# Altium schematic sheet power_supply.SchDoc: Triumvi - MCU - Power supply
size Letter; Author: Ye-Sheng Kuo; Revision: 9; SheetNumber: 3; SheetTotal: 5
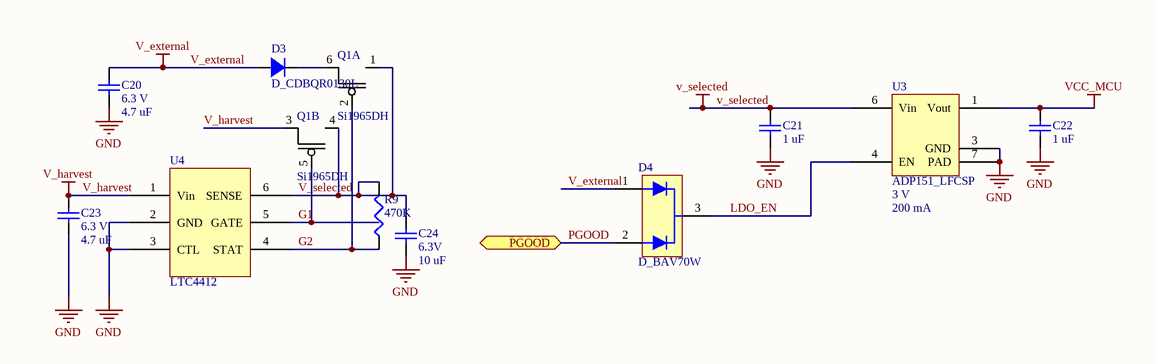
[diagram p0: power_supply.SchDoc]

## Parts
C20  value 4.7 uF  voltage rated: 6.3 V  [0402]  (hidden comment: Ceramic capacitor)
C21  value 1 uF  [0402]  (hidden comment: Ceramic capacitor)
C22  value 1 uF  [0402]  (hidden comment: Ceramic capacitor)
C23  value 4.7 uF  voltage rated: 6.3 V  [0402]  (hidden comment: Ceramic capacitor)
C24  value 10 uF  voltage rated: 6.3V  [0603]  (hidden comment: Ceramic capacitor)
D3  D_CDBQR0130L  [0402 - DIODE]
D4  D_BAV70W  [SOT323]
Q1  Si1965DH  [SC70-6]  (parts A,B of 2)
R9  value 470K  [0402]  (hidden comment: Chip resistor)
U3  ADP151_LFCSP  Voltage: 3 V  Current: 200 mA  [CP-6-3]
U4  LTC4412  [TSOT-23]

## Ports
PGOOD

## Nets
GND: C20.2 C21.2 C22.2 C23.2 C24.2 U3.3(GND) U3.7(PAD) U4.2(GND) U4.3(CTL)
V_external: C20.1 D3.1 D4.1
V_harvest: C23.1 Q1.3(D2) U4.1(Vin)
v_selected: C21.1 C24.1 Q1.1(S1) Q1.4(S2) R9.1 U3.6(Vin) U4.6(SENSE)
VCC_MCU: C22.1 U3.1(Vout)
G1: Q1.5(G2) U4.5(GATE)
G2: Q1.2(G1) R9.2 U4.4(STAT)
LDO_EN: D4.3 U3.4(EN)
PGOOD: D4.2 ; port PGOOD
NetD3_2: D3.2 Q1.6(D1)

## Notes on the sheet
- Title
- Date:
- Author:
- Revision:
- Sheet
- of
- University of Michigan
- File:

## Library data of the parts
C20 C23 = C_4.7u_6.3V_0402_ceramic: Ceramic capacitor, 4.7 uF, 6.3V, 0402 package; Manufacture: Murata; tolerance: 20%; Temperature rating: X5R; package: 0402; Supplier 1: Digi-Key; Supplier Part Number 1: 490-5915-1-ND
C21 C22 = C_1u_16V_0402_ceramic: Ceramic capacitor, 1 uF, 16V, 0402 package; Manufacture: TDK; tolerance: 10%; Temperature rating: X5R; voltage rated: 16 V; package: 0402; Supplier 1: Digi-Key; Supplier Part Number 1: 445-4978-1-ND
C24 = C_10u_6.3V_0603_ceramic: Ceramic capacitor, 10 uF, 0603 package; Manufacture: TDK; tolerance: 20%; package: 0603; Supplier 1: Digi-Key; Supplier Part Number 1: 445-4112-1-ND
D3 = D_CDBQR0130L: SMD Schottky Barrier Diode; package: 0402; Supplier 1: Digi-Key; Supplier Part Number 1: 641-1271-1-ND
D4 = D_BAV70W: DUAL SURFACE MOUNT SWITCHING DIODE; Supplier 1: Digi-Key; Supplier Part Number 1: BAV70W-FDICT-ND
Q1 = Si1965DH: Dual P-Channel 12 V (D-S) MOSFET; Supplier 1: Digi-Key; Supplier Part Number 1: SI1965DH-T1-GE3CT-ND
R9 = R_470K_0402: Chip resistor, 470K, 0402 package; tolerance: 5%; power: 1/16 W; package: 0402; Supplier 1: Digi-Key; Supplier Part Number 1: 541-470KJCT-ND
U3 = ADP151_LFCSP: Ultralow Noise, 200 mA,  CMOS Linear Regulator; Supplier 1: Digi-Key; Supplier Part Number 1: ADP151ACPZ-3.0-R7CT-ND
U4 = LTC4412: Low Loss PowerPath Controller in ThinSOT; Supplier 1: Digi-Key; Supplier Part Number 1: LTC4412ES6#TRMPBFCT-ND